# EAGLE design board (EAGLE 9.6.2)
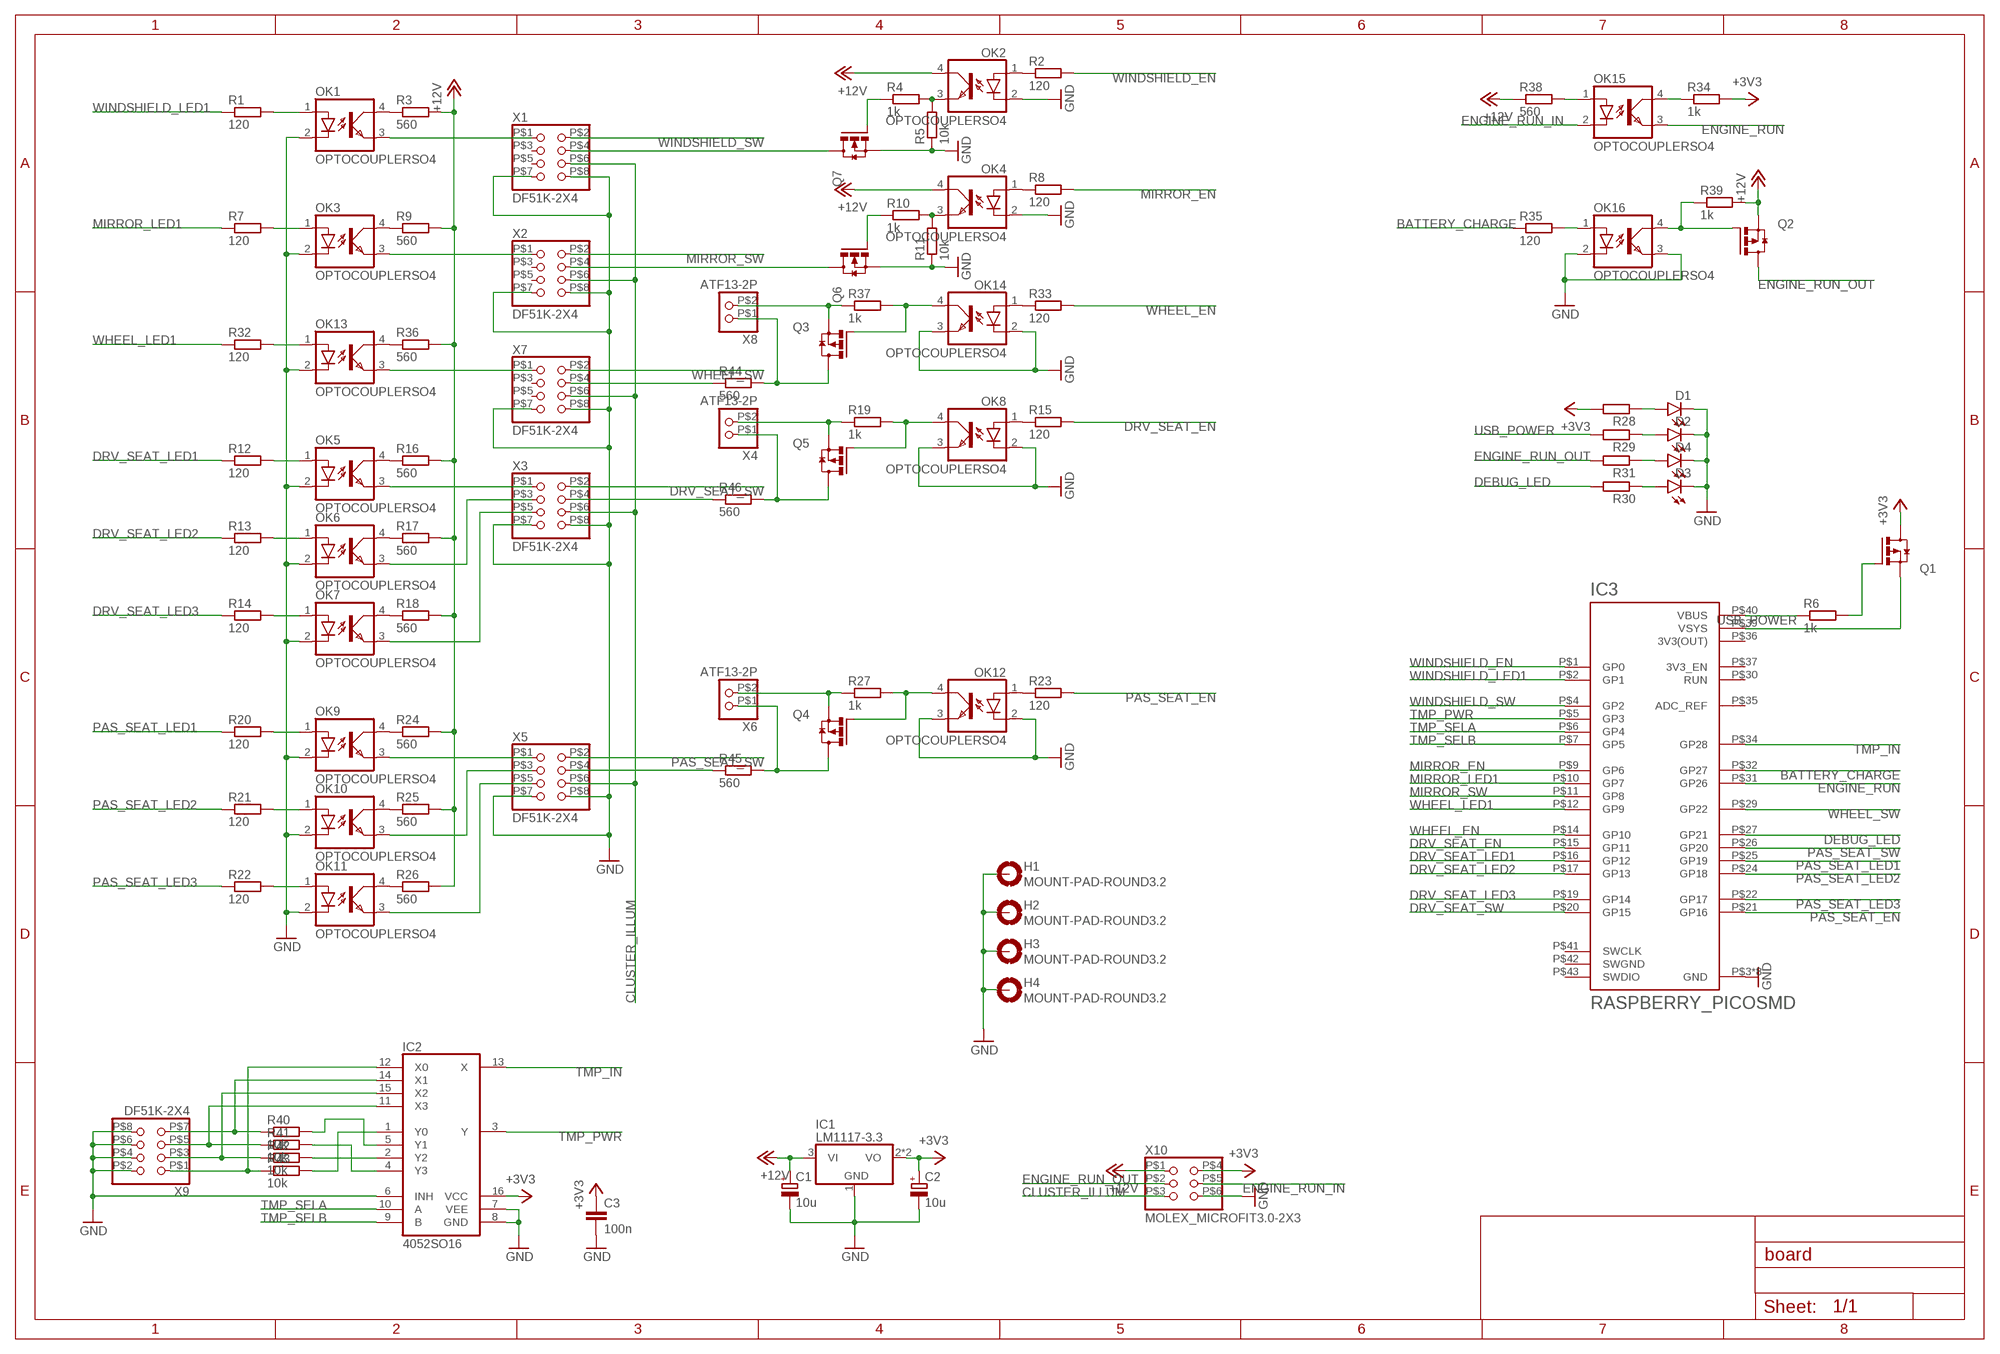
[diagram p0: schematic, sheet 1]

## Parts
C1  10u  CAPACITOR_POL4MM^2  [C_4MM]
C2  10u  CAPACITOR_POL4MM^2  [C_4MM]
C3  100n  CAPACITOR0805  [C0805]
D1  LED1206  [CHIPLED_1206]
D2  LED1206  [CHIPLED_1206]
D3  LED1206  [CHIPLED_1206]
D4  LED1206  [CHIPLED_1206]
H1  MOUNT-PAD-ROUND3.2  [3,2-PAD]
H2  MOUNT-PAD-ROUND3.2  [3,2-PAD]
H3  MOUNT-PAD-ROUND3.2  [3,2-PAD]
H4  MOUNT-PAD-ROUND3.2  [3,2-PAD]
IC1  LM1117-3.3  [SOT223]
IC2  4052SO16  [SO16]
IC3  RASPBERRY_PICOSMD  [PICO-PKG-SMD]
OK1  OPTOCOUPLERSO4  [SO04]
OK2  OPTOCOUPLERSO4  [SO04]
OK3  OPTOCOUPLERSO4  [SO04]
OK4  OPTOCOUPLERSO4  [SO04]
OK5  OPTOCOUPLERSO4  [SO04]
OK6  OPTOCOUPLERSO4  [SO04]
OK7  OPTOCOUPLERSO4  [SO04]
OK8  OPTOCOUPLERSO4  [SO04]
OK9  OPTOCOUPLERSO4  [SO04]
OK10  OPTOCOUPLERSO4  [SO04]
OK11  OPTOCOUPLERSO4  [SO04]
OK12  OPTOCOUPLERSO4  [SO04]
OK13  OPTOCOUPLERSO4  [SO04]
OK14  OPTOCOUPLERSO4  [SO04]
OK15  OPTOCOUPLERSO4  [SO04]
OK16  OPTOCOUPLERSO4  [SO04]
Q1  MOSFET_P_CHANNELSOT23  [SOT23]
Q2  MOSFET_P_CHANNELSOT23  [SOT23]
Q3  MOSFET_P_CHANNELTO252  [TO252]
Q4  MOSFET_P_CHANNELTO252  [TO252]
Q5  MOSFET_P_CHANNELTO252  [TO252]
Q6  MOSFET_N_CHANNELSOT23  [SOT23]
Q7  MOSFET_N_CHANNELSOT23  [SOT23]
R1  120  RESISTOR0805  [R0805]
R2  120  RESISTOR0805  [R0805]
R3  560  RESISTOR0805  [R0805]
R4  1k  RESISTOR0805  [R0805]
R5  10k  RESISTOR0805  [R0805]
R6  1k  RESISTOR0805  [R0805]
R7  120  RESISTOR0805  [R0805]
R8  120  RESISTOR0805  [R0805]
R9  560  RESISTOR0805  [R0805]
R10  1k  RESISTOR0805  [R0805]
R11  10k  RESISTOR0805  [R0805]
R12  120  RESISTOR0805  [R0805]
R13  120  RESISTOR0805  [R0805]
R14  120  RESISTOR0805  [R0805]
R15  120  RESISTOR0805  [R0805]
R16  560  RESISTOR0805  [R0805]
R17  560  RESISTOR0805  [R0805]
R18  560  RESISTOR0805  [R0805]
R19  1k  RESISTOR0805  [R0805]
R20  120  RESISTOR0805  [R0805]
R21  120  RESISTOR0805  [R0805]
R22  120  RESISTOR0805  [R0805]
R23  120  RESISTOR0805  [R0805]
R24  560  RESISTOR0805  [R0805]
R25  560  RESISTOR0805  [R0805]
R26  560  RESISTOR0805  [R0805]
R27  1k  RESISTOR0805  [R0805]
R28  RESISTOR0805  [R0805]
R29  RESISTOR0805  [R0805]
R30  RESISTOR0805  [R0805]
R31  RESISTOR0805  [R0805]
R32  120  RESISTOR0805  [R0805]
R33  120  RESISTOR0805  [R0805]
R34  1k  RESISTOR0805  [R0805]
R35  120  RESISTOR0805  [R0805]
R36  560  RESISTOR0805  [R0805]
R37  1k  RESISTOR0805  [R0805]
R38  560  RESISTOR0805  [R0805]
R39  1k  RESISTOR0805  [R0805]
R40  10k  RESISTOR0805  [R0805]
R41  10k  RESISTOR0805  [R0805]
R42  10k  RESISTOR0805  [R0805]
R43  10k  RESISTOR0805  [R0805]
R44  560  RESISTOR0805  [R0805]
R45  560  RESISTOR0805  [R0805]
R46  560  RESISTOR0805  [R0805]
X1  DF51K-2X4  [DF51K-2X4]
X2  DF51K-2X4  [DF51K-2X4]
X3  DF51K-2X4  [DF51K-2X4]
X4  ATF13-2P  [ATF13-2P]
X5  DF51K-2X4  [DF51K-2X4]
X6  ATF13-2P  [ATF13-2P]
X7  DF51K-2X4  [DF51K-2X4]
X8  ATF13-2P  [ATF13-2P]
X9  DF51K-2X4  [DF51K-2X4]
X10  MOLEX_MICROFIT3.0-2X3  [MOLEX_MICROFIT3.0-2X3]

## Nets
+3V3: C2.+ C3.1 IC1.2(VO) IC1.4(VO) IC2.16(VCC) Q1.3(D) R28.2 R34.2 X10.P$4
+12V: C1.+ IC1.3(VI) OK2.4(COL) OK4.4(COL) Q2.2(S) R3.2 R9.2 R16.2 R17.2 R18.2 R24.2 R25.2 R26.2 R36.2 R38.1 R39.2 X10.P$1
BATTERY_CHARGE: IC3.P$32(GP27) R35.1
CLUSTER_ILLUM: X1.P$6 X2.P$6 X3.P$6 X5.P$6 X7.P$6 X10.P$3
DEBUG_LED: IC3.P$27(GP21) R30.2
DRV_SEAT_EN: IC3.P$15(GP11) R15.2
DRV_SEAT_LED1: IC3.P$16(GP12) R12.1
DRV_SEAT_LED2: IC3.P$17(GP13) R13.1
DRV_SEAT_LED3: IC3.P$19(GP14) R14.1
DRV_SEAT_SW: IC3.P$20(GP15) X3.P$2
ENGINE_RUN: IC3.P$31(GP26) OK15.3(EMIT)
ENGINE_RUN_IN: OK15.2(C) X10.P$5
ENGINE_RUN_OUT: Q2.3(D) R31.2 X10.P$2
GND: C1.- C2.- C3.2 D1.C D2.C D3.C D4.C H1.B3,2(MOUNT) H1.P$1(MOUNT) H1.P$2(MOUNT) H1.P$3(MOUNT) H1.P$4(MOUNT) H1.P$5(MOUNT) H1.P$6(MOUNT) H1.P$7(MOUNT) H1.P$8(MOUNT) H2.B3,2(MOUNT) H2.P$1(MOUNT) H2.P$2(MOUNT) H2.P$3(MOUNT) H2.P$4(MOUNT) H2.P$5(MOUNT) H2.P$6(MOUNT) H2.P$7(MOUNT) H2.P$8(MOUNT) H3.B3,2(MOUNT) H3.P$1(MOUNT) H3.P$2(MOUNT) H3.P$3(MOUNT) H3.P$4(MOUNT) H3.P$5(MOUNT) H3.P$6(MOUNT) H3.P$7(MOUNT) H3.P$8(MOUNT) H4.B3,2(MOUNT) H4.P$1(MOUNT) H4.P$2(MOUNT) H4.P$3(MOUNT) H4.P$4(MOUNT) H4.P$5(MOUNT) H4.P$6(MOUNT) H4.P$7(MOUNT) H4.P$8(MOUNT) IC1.1(GND) IC2.6(INH) IC2.7(VEE) IC2.8(GND) IC3.P$3(GND) IC3.P$8(GND) IC3.P$13(GND) IC3.P$18(GND) IC3.P$23(GND) IC3.P$28(GND) IC3.P$33(GND) IC3.P$38(GND) OK1.2(C) OK2.2(C) OK3.2(C) OK4.2(C) OK5.2(C) OK6.2(C) OK7.2(C) OK8.2(C) OK8.3(EMIT) OK9.2(C) OK10.2(C) OK11.2(C) OK12.2(C) OK12.3(EMIT) OK13.2(C) OK14.2(C) OK14.3(EMIT) OK16.2(C) OK16.3(EMIT) Q6.2(S) Q7.2(S) R5.1 R11.1 X1.P$7 X1.P$8 X2.P$7 X2.P$8 X3.P$7 X3.P$8 X5.P$7 X5.P$8 X7.P$7 X7.P$8 X9.P$2 X9.P$4 X9.P$6 X9.P$8 X10.P$6
MIRROR_EN: IC3.P$9(GP6) R8.2
MIRROR_LED1: IC3.P$10(GP7) R7.1
MIRROR_SW: IC3.P$11(GP8) X2.P$2
N$1: OK1.3(EMIT) X1.P$1
N$2: OK1.4(COL) R3.1
N$3: OK3.4(COL) R9.1
N$4: OK13.4(COL) R36.1
N$5: IC2.1(Y0) R43.2
N$6: IC2.2(Y2) R42.2
N$7: OK5.4(COL) R16.1
N$8: OK6.4(COL) R17.1
N$9: OK7.4(COL) R18.1
N$10: OK9.4(COL) R24.1
N$11: OK10.4(COL) R25.1
N$12: OK11.4(COL) R26.1
N$13: OK3.3(EMIT) X2.P$1
N$14: OK13.3(EMIT) X7.P$1
N$15: IC2.4(Y3) R41.2
N$16: IC2.5(Y1) R40.2
N$17: OK9.3(EMIT) X5.P$1
N$18: OK5.3(EMIT) X3.P$1
N$19: OK6.3(EMIT) X3.P$3
N$20: OK7.3(EMIT) X3.P$5
N$21: OK10.3(EMIT) X5.P$3
N$22: OK11.3(EMIT) X5.P$5
N$23: OK1.1(A) R1.2
N$24: OK3.1(A) R7.2
N$25: OK13.1(A) R32.2
N$27: D1.A R28.1
N$28: OK5.1(A) R12.2
N$29: OK6.1(A) R13.2
N$30: OK7.1(A) R14.2
N$31: OK9.1(A) R20.2
N$32: OK10.1(A) R21.2
N$33: OK11.1(A) R22.2
N$35: IC2.14(X1) R40.1 X9.P$7
N$36: OK2.1(A) R2.1
N$37: OK2.3(EMIT) R4.2 R5.2
N$38: Q7.3(D) X1.P$4
N$39: Q7.1(G) R4.1
N$40: Q6.3(D) X2.P$4
N$41: OK4.3(EMIT) R10.2 R11.2
N$42: OK4.1(A) R8.1
N$43: Q6.1(G) R10.1
N$44: OK14.1(A) R33.1
N$45: Q3.2(S) R37.1 X8.P$2
N$46: OK14.4(COL) Q3.1(G) R37.2
N$47: Q3.3(D) R44.2 X8.P$1
N$48: R44.1 X7.P$4
N$49: R46.1 X3.P$4
N$50: Q5.3(D) R46.2 X4.P$1
N$51: OK8.1(A) R15.1
N$52: Q5.2(S) R19.1 X4.P$2
N$53: OK8.4(COL) Q5.1(G) R19.2
N$54: R45.1 X5.P$4
N$55: Q4.3(D) R45.2 X6.P$1
N$56: OK15.1(A) R38.2
N$57: Q4.2(S) R27.1 X6.P$2
N$58: OK12.1(A) R23.1
N$59: OK12.4(COL) Q4.1(G) R27.2
N$60: OK15.4(COL) R34.1
N$61: OK16.1(A) R35.2
N$62: OK16.4(COL) Q2.1(G) R39.1
N$63: IC2.11(X3) R41.1 X9.P$5
N$64: Q1.1(G) R6.2
N$65: IC3.P$39(VSYS) Q1.2(S)
N$66: D2.A R29.1
N$67: D4.A R31.1
N$69: D3.A R30.1
N$70: IC2.15(X2) R42.1 X9.P$3
N$71: IC2.12(X0) R43.1 X9.P$1
PAS_SEAT_EN: IC3.P$21(GP16) R23.2
PAS_SEAT_LED1: IC3.P$25(GP19) R20.1
PAS_SEAT_LED2: IC3.P$24(GP18) R21.1
PAS_SEAT_LED3: IC3.P$22(GP17) R22.1
PAS_SEAT_SW: IC3.P$26(GP20) X5.P$2
TMP_IN: IC2.13(X) IC3.P$34(GP28)
TMP_PWR: IC2.3(Y) IC3.P$5(GP3)
TMP_SELA: IC2.10(A) IC3.P$6(GP4)
TMP_SELB: IC2.9(B) IC3.P$7(GP5)
USB_POWER: IC3.P$40(VBUS) R6.1 R29.2
WHEEL_EN: IC3.P$14(GP10) R33.2
WHEEL_LED1: IC3.P$12(GP9) R32.1
WHEEL_SW: IC3.P$29(GP22) X7.P$2
WINDSHIELD_EN: IC3.P$1(GP0) R2.2
WINDSHIELD_LED1: IC3.P$2(GP1) R1.1
WINDSHIELD_SW: IC3.P$4(GP2) X1.P$2
Unconnected: IC3.P$30(RUN) IC3.P$35(ADC_REF) IC3.P$37(3V3_EN) IC3.P$41(SWCLK) IC3.P$43(SWDIO) X1.P$3 X1.P$5 X2.P$3 X2.P$5 X7.P$3 X7.P$5

## Power pins joined to a net without a drawn wire
3V3(OUT): IC3.P$36(3V3(OUT))
SWGND: IC3.P$42(SWGND)

## Library data of the parts
C1 C2 = SMD:CAPACITOR_POL
C3 = SMD:CAPACITOR
D1-D4 = SMD:LED
H1-H4 = THT:MOUNT-PAD-ROUND: MOUNTING PAD, round
IC1 = SMD:LM1117-3.3
IC2 = SMD:4052
IC3 = SMD:RASPBERRY_PICO: Raspberry Pi Pico
OK1-OK16 = SMD:OPTOCOUPLER
Q1-Q5 = SMD:MOSFET_P_CHANNEL
Q6 Q7 = SMD:MOSFET_N_CHANNEL
R1-R46 = SMD:RESISTOR
X1-X3 X5 X7 X9 = THT:DF51K-2X4
X4 X6 X8 = THT:ATF13-2P
X10 = THT:MOLEX_MICROFIT3.0-2X3

## Board
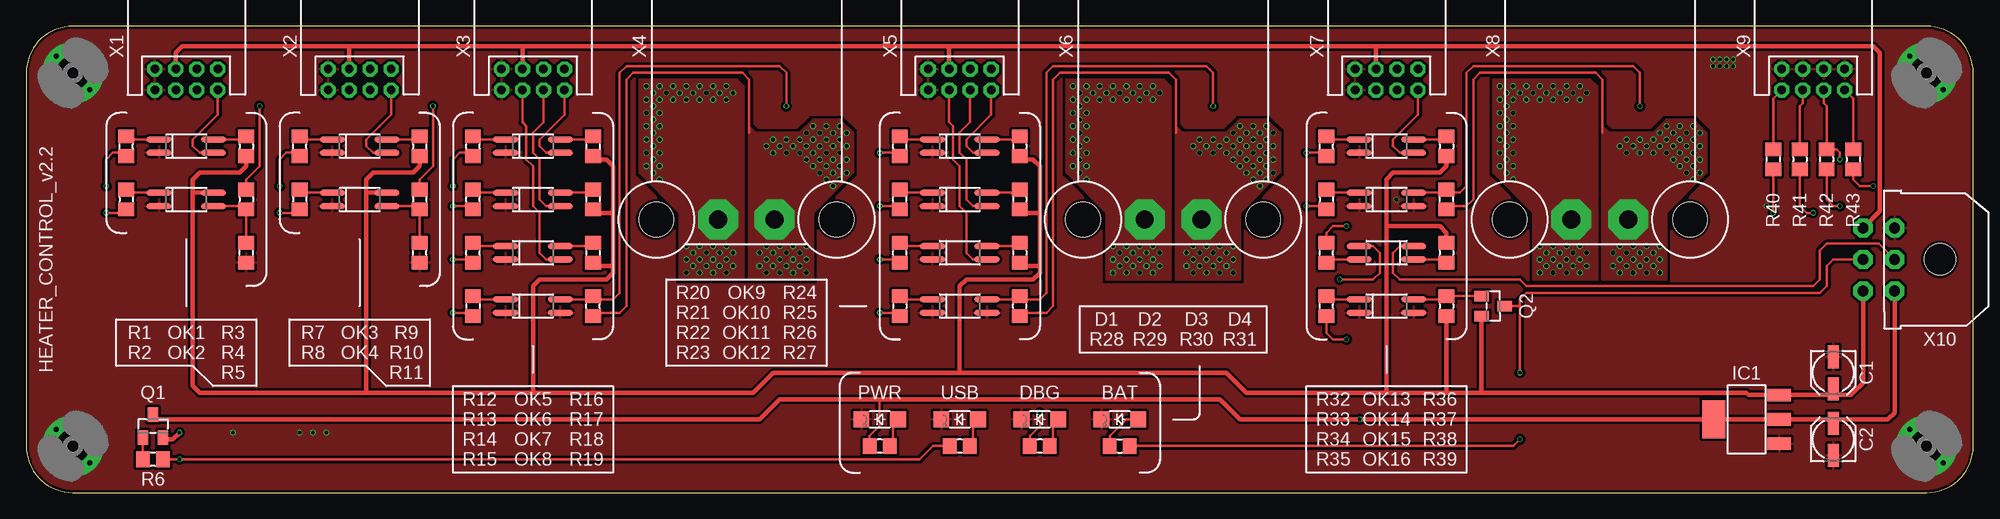
[diagram p1: board, top side]
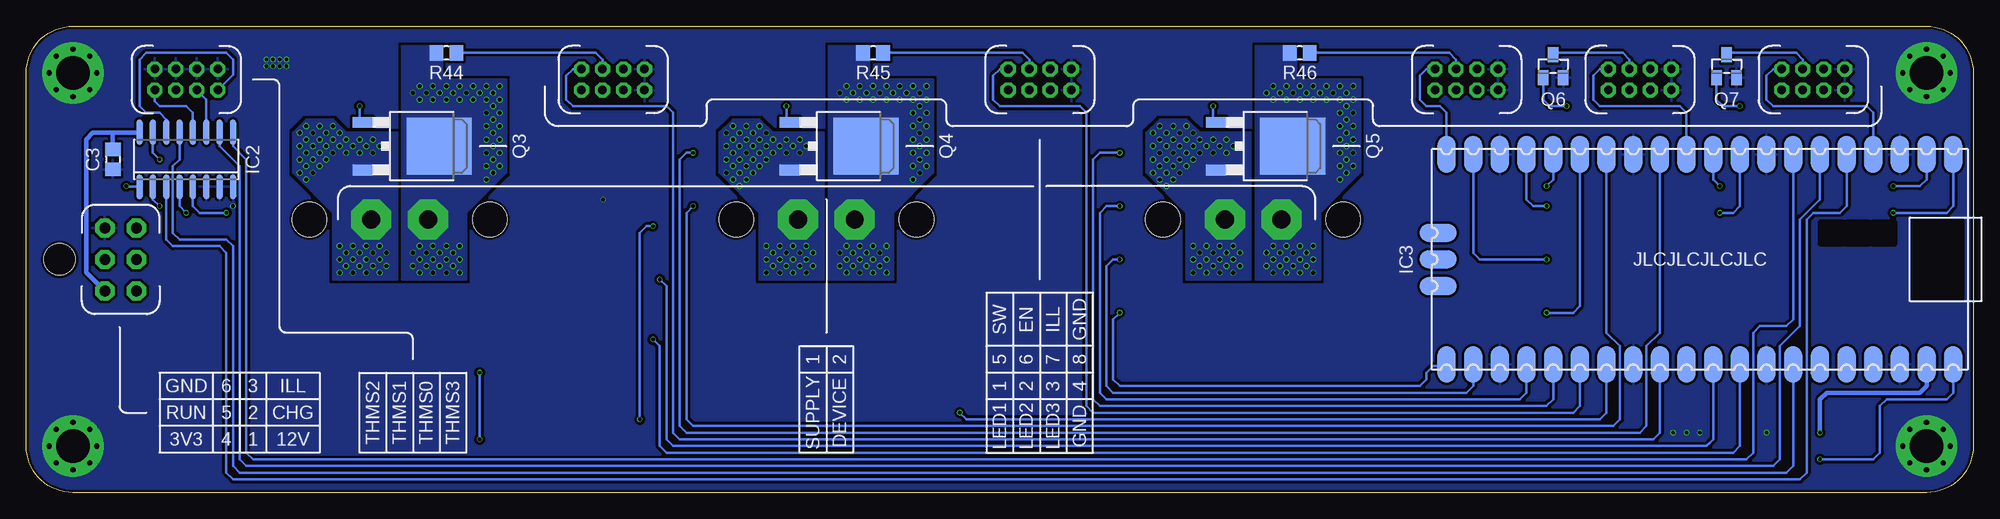
[diagram p2: board, bottom side, seen from below]

Size 185.42 x 44.45 mm. Coordinates in mm from the lower left corner, seen from the top.
Outline: 0,40.01 0,4.45 arc90 4.45,0 180.97,0 arc90 185.42,4.45 185.42,40.01 arc90 180.97,44.45 4.45,44.45 arc90 0,40.01
Copper layers (1*16): Top 0.035mm / dielectric 1.6mm / Bottom 0.035mm
Design rules "jlc-pcb *": minimum track width 5mil, minimum drill 0.3mm, track to track 5mil, track to pad 5mil, pad to pad 5mil, via to via 5mil, smd to smd 5mil, copper to edge 0.2mm, drill to drill 6mil, minimum pad ring 10mil, minimum via ring 3mil, stop-mask expansion 4mil, vias tented up to drill 16mil, thermal gap 10mil

### Footprints (pad centres in the part's own frame; a part is rotated, then mirrored left to right if it is on the bottom)
C_4MM = smd 2.184 x 1.067: + 1.524,0; - -1.524,0
C0805 = smd 1.3 x 1.5: 1 -0.95,0; 2 0.95,0
CHIPLED_1206 = smd 1.5 x 1.5: A 0,-1.75; C 0,1.75
3,2-PAD = drill 3.2 pad 5.842: B3,2 0,0 | drill 0.5: P$1 0,2.261; P$2 0,-2.261; P$3 2.261,0; P$4 -2.261,0; P$5 -1.598,1.598; P$6 1.598,1.598; P$7 -1.598,-1.598; P$8 1.598,-1.598
SOT223 = smd 1.219 x 2.235: 1 -2.311,-3.099; 2 0,-3.099; 3 2.311,-3.099 | smd 3.6 x 2.2: 4 0,3.099
SO16 = smd 0.559 x 2.388: 1 -4.445,-2.6; 2 -3.175,-2.6; 3 -1.905,-2.6; 4 -0.635,-2.6; 5 0.635,-2.6; 6 1.905,-2.6; 7 3.175,-2.6; 8 4.445,-2.6; 9 4.445,2.6; 10 3.175,2.6; 11 1.905,2.6; 12 0.635,2.6; 13 -0.635,2.6; 14 -1.905,2.6; 15 -3.175,2.6; 16 -4.445,2.6
PICO-PKG-SMD = smd 3.5 x 1.7: P$1 -10,24.13; P$2 -10,21.59; P$3 -10,19.05; P$4 -10,16.51; P$5 -10,13.97; P$6 -10,11.43; P$7 -10,8.89; P$8 -10,6.35; P$9 -10,3.81; P$10 -10,1.27; P$11 -10,-1.27; P$12 -10,-3.81; P$13 -10,-6.35; P$14 -10,-8.89; P$15 -10,-11.43; P$16 -10,-13.97; P$17 -10,-16.51; P$18 -10,-19.05; P$19 -10,-21.59; P$20 -10,-24.13; P$21 10,-24.13; P$22 10,-21.59; P$23 10,-19.05; P$24 10,-16.51; P$25 10,-13.97; P$26 10,-11.43; P$27 10,-8.89; P$28 10,-6.35; P$29 10,-3.81; P$30 10,-1.27; P$31 10,1.27; P$32 10,3.81; P$33 10,6.35; P$34 10,8.89; P$35 10,11.43; P$36 10,13.97; P$37 10,16.51; P$38 10,19.05; P$39 10,21.59; P$40 10,24.13 | smd 1.7 x 3.5: P$41 -2.54,-24.925; P$42 0,-24.925; P$43 2.54,-24.925
SO04 = smd 0.559 x 2.388: 1 -0.635,-2.6; 2 0.635,-2.6; 3 0.635,2.6; 4 -0.635,2.6
SOT23 = smd 1 x 1.4: 1 -0.95,-1.1; 2 0.95,-1.1; 3 0,1.1
TO252 = smd 1.016 x 1.905: 1 -2.28,-4.8; 2 2.28,-4.8 | smd 5.4 x 6.2: 3 0,2.5
R0805 = smd 1.3 x 1.5: 1 -0.95,0; 2 0.95,0
DF51K-2X4 = drill 0.8 octagon: P$1 -3,1; P$2 -3,-1; P$3 -1,1; P$4 -1,-1; P$5 1,1; P$6 1,-1; P$7 3,1; P$8 3,-1
ATF13-2P = drill 1.7 pad 3.81 octagon: P$1 2.7,0; P$2 -2.7,0 | hole 3.3: -8.585,0; 8.585,0
MOLEX_MICROFIT3.0-2X3 = drill 1.02 pad 1.778 octagon: P$1 -3,7.32; P$2 0,7.32; P$3 3,7.32; P$4 -3,4.32; P$5 0,4.32; P$6 3,4.32 | hole 3: 0,0

### Placement (x,y rotation side)
C1  172.09,11.43 270 top
C2  172.09,5.08 90 top
C3  177.16,31.75 270 bottom
D1  81.28,6.99 90 top
D2  88.9,6.99 90 top
D3  96.52,6.99 90 top
D4  104.14,6.99 90 top
H1  4.45,40.01 0 top
H2  4.45,4.45 0 top
H3  180.97,4.45 0 top
H4  180.97,40.01 0 top
IC1  163.83,6.99 90 top
IC2  170.18,31.75 0 bottom
IC3  26.04,22.23 270 bottom
OK1  15.24,33.02 270 top
OK2  15.24,27.94 270 top
OK3  31.75,33.02 270 top
OK4  31.75,27.94 270 top
OK5  48.26,33.02 270 top
OK6  48.26,27.94 270 top
OK7  48.26,22.86 270 top
OK8  48.26,17.78 270 top
OK9  88.9,33.02 270 top
OK10  88.9,27.94 270 top
OK11  88.9,22.86 270 top
OK12  88.9,17.78 270 top
OK13  129.54,33.02 270 top
OK14  129.54,27.94 270 top
OK15  129.54,22.86 90 top
OK16  129.54,17.78 270 top
Q1  12.06,6.35 0 top
Q2  139.7,17.78 270 top
Q3  148.59,33.02 270 bottom
Q4  107.95,33.02 270 bottom
Q5  67.31,33.02 270 bottom
Q6  40.01,40.64 0 bottom
Q7  23.5,40.64 0 bottom
R1  9.53,33.02 90 top
R2  9.53,27.94 270 top
R3  20.95,33.02 270 top
R4  20.95,27.94 270 top
R5  20.95,22.86 90 top
R6  12.06,3.17 180 top
R7  26.04,33.02 90 top
R8  26.04,27.94 270 top
R9  37.47,33.02 270 top
R10  37.47,27.94 270 top
R11  37.47,22.86 90 top
R12  42.55,33.02 90 top
R13  42.55,27.94 90 top
R14  42.55,22.86 90 top
R15  42.55,17.78 270 top
R16  53.98,33.02 270 top
R17  53.98,27.94 270 top
R18  53.98,22.86 270 top
R19  53.98,17.78 90 top
R20  83.19,33.02 90 top
R21  83.19,27.94 90 top
R22  83.19,22.86 90 top
R23  83.19,17.78 270 top
R24  94.61,33.02 270 top
R25  94.61,27.94 270 top
R26  94.61,22.86 270 top
R27  94.61,17.78 90 top
R28  81.28,4.45 180 top
R29  88.9,4.45 180 top
R30  96.52,4.45 180 top
R31  104.14,4.45 0 top
R32  123.83,33.02 90 top
R33  123.83,27.94 270 top
R34  123.83,22.86 90 top
R35  123.83,17.78 90 top
R36  135.25,33.02 270 top
R37  135.25,27.94 90 top
R38  135.25,22.86 270 top
R39  135.25,17.78 270 top
R40  166.37,31.75 270 top
R41  168.91,31.75 270 top
R42  171.45,31.75 270 top
R43  173.99,31.75 270 top
R44  145.41,41.91 180 bottom
R45  104.78,41.91 180 bottom
R46  64.14,41.91 180 bottom
X1  15.24,39.37 180 top
X2  31.75,39.37 180 top
X3  48.26,39.37 180 top
X4  68.58,26.04 180 top
X5  88.9,39.37 180 top
X6  109.22,26.04 180 top
X7  129.54,39.37 180 top
X8  149.86,26.04 180 top
X9  170.18,39.37 180 top
X10  182.25,22.23 90 top

### Tracks (layer width: path | path; a pad name or v marks a point on that pad's centre or on a via)
+3V3  (via drill 0.35)
  Top 0.254: R34.2 123.83,24.77 124.46,25.4 v125.73,25.4 | R28.2 80.33,5.4 81.28,6.35 81.28,8.89
  Top 0.406: 172.09,6.99 IC1.2 IC1.4 v127,6.99 115.57,6.99 113.67,8.89 81.28,8.89 71.75,8.89 69.85,6.99 12.38,6.99 12.06,7.3 Q1.3 | 172.09,6.99 177.29,6.99 177.93,7.62 X10.P$4 | C2.+ 172.09,6.99
  Bottom 0.254: v125.73,25.4 126.36,25.4 127,24.77 v127,6.99
  Bottom 0.406: C3.1 177.16,34.29 | IC2.16 174.69,34.29 177.16,34.29 | 177.16,34.29 179.07,34.29 179.71,33.66 179.71,21 X10.P$4
+12V
  Top 0.406: R3.2 20.95,31.11 20.32,30.48 16.51,30.48 15.88,29.84 15.88,28.57 | R9.2 37.47,31.11 36.83,30.48 33.02,30.48 32.38,29.84 32.38,28.57 | OK2.4 15.88,28.57 | OK4.4 32.38,28.57 | 55.88,21.59 55.88,20.95 55.24,20.32 48.9,20.32 48.26,19.68 48.26,9.53 | 55.88,21.59 55.88,26.67 | 55.88,26.67 55.88,31.11 55.24,31.75 54.3,31.75 R16.2 | R17.2 54.3,26.67 55.88,26.67 | R18.2 54.3,21.59 55.88,21.59 | R36.2 135.25,31.11 134.62,30.48 130.18,30.48 129.54,29.84 129.54,25.4 | R38.1 135.25,24.77 134.62,25.4 129.54,25.4 | 96.52,26.67 96.52,21.59 | 96.52,21.59 96.52,20.95 95.89,20.32 89.53,20.32 88.9,19.68 88.9,11.43 | R26.2 94.94,21.59 96.52,21.59 | R25.2 94.93,26.99 95.25,26.67 96.52,26.67 | R24.2 94.94,31.75 95.89,31.75 96.52,31.11 96.52,26.67 | 172.09,9.3 173.76,9.3 174.93,10.46 X10.P$1 | 172.09,9.3 IC1.3 164.06,9.3 163.83,9.53 138.6,9.53 | C1.+ 172.09,9.3 | 15.88,28.57 15.88,10.16 16.51,9.53 32.38,9.53 | 138.6,9.53 135.25,9.53 | 135.25,9.53 129.54,9.53 | 129.54,9.53 116.2,9.53 114.3,11.43 88.9,11.43 | 88.9,11.43 71.12,11.43 69.22,9.53 48.26,9.53 | 48.26,9.53 32.38,9.53 | 32.38,28.57 32.38,9.53 | 129.54,25.4 129.54,9.53 | R39.2 135.25,9.53 | Q2.2 138.6,9.53
BATTERY_CHARGE  (via drill 0.35)
  Top 0.254: v125.73,14.61 124.46,14.61 123.83,15.24 R35.1
  Bottom 0.254: IC3.P$32 22.23,4.45 22.86,3.81 124.46,3.81 125.09,4.45 125.09,13.97 v125.73,14.61
CLUSTER_ILLUM
  Top 0.406: X1.P$6 14.24,41.91 14.88,42.55 30.75,42.55 | 30.75,42.55 47.26,42.55 | 47.26,42.55 87.9,42.55 | 87.9,42.55 128.54,42.55 | X2.P$6 30.75,42.55 | X3.P$6 47.26,42.55 | X5.P$6 87.9,42.55 | X7.P$6 128.54,42.55 | 128.54,42.55 175.9,42.55 176.53,41.91 176.53,26.83 X10.P$3
DEBUG_LED  (via drill 0.35)
  Top 0.254: R30.2 95.57,5.4 96.52,6.35 v96.52,7.62
  Bottom 0.254: v96.52,7.62 95.89,6.99 35.56,6.99 34.92,7.62 IC3.P$27
DRV_SEAT_EN  (via drill 0.35)
  Top 0.254: R15.2 42.23,17.14 v40.64,17.14
  Bottom 0.254: IC3.P$15 37.47,17.78 38.1,17.14 v40.64,17.14
DRV_SEAT_LED1  (via drill 0.35)
  Top 0.254: v40.64,29.21 40.64,31.75 41.27,32.38 42.23,32.38 R12.1
  Bottom 0.254: IC3.P$16 40.01,29.84 v40.64,29.21
DRV_SEAT_LED2  (via drill 0.35)
  Top 0.254: v40.64,27.3 42.23,27.3 R13.1
  Bottom 0.254: IC3.P$17 42.55,27.94 41.91,27.3 v40.64,27.3
DRV_SEAT_LED3  (via drill 0.35)
  Top 0.254: v40.64,22.23 42.23,22.23 R14.1
  Bottom 0.254: IC3.P$19 47.62,22.86 46.99,22.23 v40.64,22.23
DRV_SEAT_SW
  Bottom 0.254: X3.P$2 52.07,40.37 52.7,39.73 52.7,37.47 52.07,36.83 50.8,36.83 50.16,36.2 IC3.P$20
ENGINE_RUN  (via drill 0.35)
  Top 0.254: OK15.3 128.27,23.5 128.91,22.86 128.91,20.95 128.27,20.32 v125.09,20.32
  Bottom 0.254: IC3.P$31 24.77,5.08 25.08,4.76 25.4,4.45 123.83,4.45 124.46,5.08 124.46,19.68 v125.09,20.32
ENGINE_RUN_IN
  Top 0.254: OK15.2 130.81,23.5 130.18,22.86 130.18,20.95 130.81,20.32 142.24,20.32 142.88,19.68 170.18,19.68 170.81,20.32 170.81,23.09 171.45,23.72 176.43,23.72 X10.P$5
ENGINE_RUN_OUT  (via drill 0.35)
  Top 0.254: 142.24,17.78 142.24,18.41 142.88,19.05 170.81,19.05 171.45,19.68 171.45,21.59 172.09,22.23 X10.P$2 | Q2.3 142.24,17.78 | 142.24,17.78 v142.24,11.43 | R31.2 141.6,4.45 v142.24,5.08
  Bottom 0.254: v142.24,11.43 v142.24,5.08
GND  (via drill 0.35)
  other vias: 130.49,27.94 165.74,27.3 19.68,5.71 28.57,5.71 27.3,5.71 26.04,5.71 160.66,41.27 161.29,41.27 161.93,41.27 162.56,41.27 162.56,40.64 161.93,40.64 161.29,40.64 160.66,40.64
  pour Top (isolate 0.254, rank 2): 0,44.45 185.42,44.45 185.42,0 0,0
  pour Bottom (isolate 0.254, rank 2): 0,44.45 185.42,44.45 185.42,0 0,0
MIRROR_EN  (via drill 0.35)
  Top 0.254: R8.2 25.88,26.83 25.71,26.67 v24.13,26.67
  Bottom 0.254: IC3.P$9 22.23,27.3 22.86,26.67 v24.13,26.67
MIRROR_LED1  (via drill 0.35)
  Top 0.254: R7.1 25.72,32.38 24.77,32.38 24.13,31.75 v24.13,29.21
  Bottom 0.254: IC3.P$10 24.77,29.84 v24.13,29.21
MIRROR_SW
  Bottom 0.254: X2.P$2 35.56,40.37 36.2,39.73 36.2,37.47 35.56,36.83 27.94,36.83 27.3,36.2 IC3.P$11
N$1
  Top 0.254: OK1.3 16.51,32.38 15.88,33.02 15.88,33.66 18.24,36.02 X1.P$1
N$2
  Top 0.254: R3.1 20.64,33.66 OK1.4
N$3
  Top 0.254: OK3.4 37.15,33.66 R9.1
N$4
  Top 0.254: OK13.4 134.94,33.66 R36.1
N$5  (via drill 0.35)
  Top 0.254: R43.2 173.99,29.84 174.62,29.21 v175.9,29.21
  Bottom 0.254: v175.9,29.21 175.84,29.15 IC2.1
N$6  (via drill 0.35)
  Top 0.254: v172.72,27.3 172.09,27.3 171.45,27.94 R42.2
  Bottom 0.254: v172.72,27.3 173.35,27.94 IC2.2
N$7
  Top 0.254: OK5.4 53.66,33.66 R16.1
N$8
  Top 0.254: OK6.4 53.66,28.57 R17.1
N$9
  Top 0.254: OK7.4 53.66,23.5 R18.1
N$10
  Top 0.254: OK9.4 94.3,33.66 R24.1
N$11
  Top 0.254: OK10.4 94.3,28.57 R25.1
N$12
  Top 0.254: OK11.4 94.3,23.5 R26.1
N$13
  Top 0.254: OK3.3 33.02,32.38 32.38,33.02 32.38,33.66 33.66,34.92 34.75,36.02 X2.P$1
N$14
  Top 0.254: OK13.3 130.81,32.38 130.18,33.02 130.18,33.66 132.54,36.02 X7.P$1
N$15  (via drill 0.35)
  Top 0.254: R41.2 168.91,27.3 169.54,26.67 v170.18,26.67
  Bottom 0.254: v170.18,26.67 170.81,27.3 IC2.4
N$16  (via drill 0.35)
  Top 0.254: R40.2 v166.37,26.67
  Bottom 0.254: IC2.5 169.54,27.3 168.91,26.67 v166.37,26.67
N$17
  Top 0.254: OK9.3 90.17,32.38 89.53,33.02 89.53,33.66 91.9,36.02 X5.P$1
N$18
  Top 0.254: OK5.3 49.53,32.38 48.9,33.02 48.9,33.66 51.26,36.02 X3.P$1
N$19
  Top 0.254: OK6.3 49.53,27.3 48.9,27.94 48.9,31.75 48.26,32.38 48.26,34.29 49.26,35.29 X3.P$3
N$20
  Top 0.254: OK7.3 49.53,22.23 48.9,22.86 48.9,26.67 48.26,27.3 48.26,31.11 47.62,31.75 47.62,34.92 47.26,35.29 X3.P$5
N$21
  Top 0.254: OK10.3 90.17,27.3 89.53,27.94 89.53,31.75 88.9,32.38 88.9,34.29 89.9,35.29 X5.P$3
N$22
  Top 0.254: OK11.3 90.17,22.23 89.53,22.86 89.53,26.67 88.9,27.3 88.9,31.11 88.27,31.75 88.27,34.92 87.9,35.29 X5.P$5
N$23
  Top 0.254: OK1.1 9.84,33.66 R1.2
N$24
  Top 0.254: OK3.1 26.35,33.66 R7.2
N$25
  Top 0.254: OK13.1 124.14,33.66 R32.2
N$27
  Top 0.254: R28.1 82.55,4.76 82.55,6.5 D1.A
N$28
  Top 0.254: OK5.1 42.86,33.66 R12.2
N$29
  Top 0.254: OK6.1 42.86,28.57 R13.2
N$30
  Top 0.254: OK7.1 42.86,23.5 R14.2
N$31
  Top 0.254: OK9.1 83.5,33.66 R20.2
N$32
  Top 0.254: OK10.1 83.5,28.57 R21.2
N$33
  Top 0.254: R22.2 83.5,23.5 OK11.1
N$35
  Top 0.254: X9.P$7 166.37,37.56 R40.1
  Bottom 0.254: IC2.14 172.09,35.56 172.72,36.2 173.99,36.2 174.62,36.83 174.62,41.27 173.99,41.91 166.37,41.91 165.74,41.27 165.74,39.81 X9.P$7
N$36
  Top 0.254: OK2.1 9.84,28.57 R2.1
N$37
  Top 0.254: OK2.3 20.64,27.3 R4.2 R5.2
N$38
  Bottom 0.254: X1.P$4 16.24,41.27 16.88,41.91 23.5,41.91 23.32,41.27 Q7.3
N$39  (via drill 0.35)
  Top 0.254: R4.1 20.95,29.84 22.23,31.11 v22.23,36.83
  Bottom 0.254: Q7.1 24.45,37.47 23.81,36.83 v22.23,36.83
N$40
  Bottom 0.254: X2.P$4 32.75,41.27 33.38,41.91 39.84,41.91 Q6.3
N$41
  Top 0.254: OK4.3 37.15,27.3 R10.2 R11.2
N$42
  Top 0.254: OK4.1 26.35,28.57 R8.1
N$43  (via drill 0.35)
  Top 0.254: R10.1 37.47,29.84 38.73,31.11 v38.73,36.83
  Bottom 0.254: Q6.1 40.95,37.47 40.32,36.83 v38.73,36.83
N$44
  Top 0.254: OK14.1 124.14,28.57 R33.1
N$45  (via drill 0.4)
  Top 0.254: R37.1 135.57,27.3 137.16,27.3 137.79,27.94 137.79,39.37 138.43,40.01 149.48,40.01 150.11,39.37 150.11,34.29
  other vias: 155.57,20.95 154.31,20.95 153.03,20.95 151.76,20.95 151.76,22.23 153.03,22.23 154.31,22.23 155.57,22.23 155.57,23.5 154.31,23.5 153.03,23.5 151.76,23.5 151.13,22.86 151.13,21.59 152.4,21.59 152.4,22.86 153.67,22.86 153.67,21.59 154.94,21.59 154.94,22.86 152.4,33.66 151.76,33.02 152.4,32.38 153.03,33.02 153.67,33.66 153.67,32.38 154.31,33.02 154.94,33.66 154.94,32.38 155.57,33.02 156.21,32.38 156.84,31.75 157.48,31.11 158.12,30.48 158.75,29.84 155.57,34.29 156.21,33.66 156.84,33.02 157.48,32.38 158.12,31.75 158.75,31.11 159.38,30.48 159.38,31.75 159.38,33.02 159.38,34.29 158.75,34.92 158.75,33.66 158.75,32.38 158.12,33.02 157.48,33.66 156.84,34.29 156.21,34.92 157.48,34.92 158.12,34.29
  pour Bottom (isolate 0.254, no thermals): 150.11,20.32 150.11,34.29 154.94,34.29 156.21,35.56 158.75,35.56 160.02,34.29 160.02,30.48 156.21,26.67 156.21,20.32
  pour Top (isolate 0.254, no thermals): 150.11,20.32 150.11,34.92 150.75,34.29 154.94,34.29 156.21,35.56 158.75,35.56 160.02,34.29 160.02,30.48 156.21,26.67 156.21,20.32
N$46  (via drill 0.35)
  Top 0.254: OK14.4 135.25,28.57 R37.2 135.57,28.57 136.53,28.57 137.16,29.21 137.16,40.01 137.79,40.64 153.03,40.64 153.67,40.01 v153.67,36.83
  Bottom 0.254: v153.67,36.83 153.67,35.58 Q3.1
N$47  (via drill 0.4)
  other vias: 144.15,20.95 144.15,22.23 144.15,23.5 145.41,23.5 146.69,23.5 147.96,23.5 147.96,22.23 146.69,22.23 145.41,22.23 145.41,20.95 146.69,20.95 147.96,20.95 148.59,21.59 148.59,22.86 147.32,22.86 147.32,21.59 146.05,21.59 146.05,22.86 144.78,22.86 144.78,21.59 140.34,31.11 140.97,30.48 141.6,29.84 141.6,31.11 140.97,31.75 140.34,32.38 140.34,33.66 140.97,33.02 141.6,32.38 141.6,33.66 140.97,34.29 140.34,34.92 140.34,36.2 140.97,35.56 141.6,34.92 141.6,36.2 140.97,36.83 140.34,37.47 140.34,38.73 140.97,38.1 141.6,37.47 141.6,38.73 142.24,38.1 142.88,37.47 142.88,38.73 143.51,38.1 144.15,37.47 144.15,38.73 144.78,38.1 145.41,37.47 145.41,38.73 146.05,38.1 146.69,37.47 146.69,38.73 147.32,38.1 147.96,37.47 147.96,38.73 148.59,38.1
  pour Bottom (isolate 0.254, no thermals): 149.61,20.32 149.61,42.55 145.8,42.55 145.8,40.01 145.16,39.37 139.7,39.37 139.7,30.48 143.51,26.67 143.51,20.32
  pour Top (isolate 0.254, no thermals): 148.97,39.37 139.7,39.37 139.7,30.48 143.51,26.67 143.51,20.32 149.61,20.32 149.61,38.73
N$48
  Bottom 0.254: X7.P$4 130.54,41.27 131.18,41.91 R44.1
N$49
  Bottom 0.254: X3.P$4 49.26,41.27 49.9,41.91 R46.1
N$50  (via drill 0.4)
  other vias: 59.69,30.48 59.05,31.11 60.33,31.11 59.69,31.75 59.05,32.38 60.33,32.38 59.69,33.02 59.05,33.66 60.33,33.66 59.69,34.29 59.05,34.92 60.33,34.92 59.69,35.56 59.05,36.2 60.33,36.2 59.69,36.83 59.05,37.47 60.33,37.47 59.69,38.1 59.05,38.73 60.33,38.73 60.96,38.1 61.59,37.47 61.59,38.73 62.23,38.1 62.87,37.47 62.87,38.73 63.5,38.1 64.14,37.47 64.14,38.73 64.77,38.1 65.41,37.47 65.41,38.73 66.04,38.1 66.67,37.47 66.67,38.73 67.31,38.1 60.33,29.84 62.87,20.95 64.14,20.95 65.41,20.95 66.67,20.95 62.87,22.23 62.87,23.5 64.14,23.5 65.41,23.5 66.67,23.5 66.67,22.23 65.41,22.23 64.14,22.23 63.5,22.86 63.5,21.59 64.77,22.86 64.77,21.59 66.04,22.86 66.04,21.59 67.31,22.86 67.31,21.59
  pour Bottom (isolate 0.254, no thermals): 58.42,39.37 58.42,30.48 62.23,26.67 62.23,20.32 68.33,20.32 68.33,42.55 64.52,42.55 64.52,40.01 63.88,39.37
  pour Top (isolate 0.254, no thermals): 58.42,39.37 58.42,30.48 62.23,26.67 62.23,20.32 68.33,20.32 68.33,38.73 67.69,39.37
N$51
  Top 0.254: OK8.1 42.86,18.41 R15.1
N$52  (via drill 0.4)
  Top 0.254: R19.1 54.29,17.14 56.52,17.14 57.15,17.78 57.15,39.37 57.78,40.01 68.2,40.01 68.83,39.37 68.83,34.29
  other vias: 71.12,33.66 72.39,33.66 73.66,33.66 74.93,33.66 76.2,33.66 77.47,33.66 70.48,33.02 71.12,32.38 71.75,33.02 72.39,32.38 73.03,33.02 73.66,32.38 74.3,33.02 74.93,32.38 75.56,33.02 76.2,32.38 76.83,33.02 77.47,32.38 78.11,33.02 75.56,31.75 76.83,31.75 76.2,31.11 74.3,31.75 74.93,31.11 75.56,30.48 74.3,20.95 73.03,20.95 71.75,20.95 70.48,20.95 69.85,21.59 71.12,21.59 72.39,21.59 73.66,21.59 74.3,22.23 73.03,22.23 71.75,22.23 70.48,22.23 69.85,22.86 71.12,22.86 72.39,22.86 73.66,22.86 74.3,23.5 73.03,23.5 71.75,23.5 70.48,23.5 78.11,34.29 77.47,34.92 74.3,34.29 74.93,34.92 75.56,34.29 76.2,34.92 76.83,34.29 76.83,30.48 76.2,29.84 77.47,31.11 78.11,31.75 76.83,29.21 77.47,29.84 78.11,30.48
  pour Bottom (isolate 0.254, no thermals): 68.83,20.32 68.83,34.29 73.66,34.29 74.93,35.56 77.47,35.56 78.74,34.29 78.74,30.48 74.93,26.67 74.93,20.32
  pour Top (isolate 0.254, no thermals): 68.83,20.32 68.83,34.92 69.47,34.29 73.66,34.29 74.93,35.56 77.47,35.56 78.74,34.29 78.74,30.48 74.93,26.67 74.93,20.32
N$53  (via drill 0.35)
  Top 0.254: OK8.4 53.66,18.41 R19.2 54.29,18.41 55.88,18.41 56.52,19.05 56.52,40.01 57.15,40.64 71.75,40.64 72.39,40.01 v72.39,36.83
  Bottom 0.254: v72.39,36.83 72.39,35.58 Q5.1
N$54
  Bottom 0.254: X5.P$4 89.9,41.27 90.53,41.91 R45.1
N$55  (via drill 0.4)
  other vias: 103.5,20.95 104.78,20.95 106.05,20.95 107.31,20.95 103.5,22.23 103.5,23.5 104.78,23.5 106.05,23.5 107.31,23.5 107.31,22.23 106.05,22.23 104.78,22.23 104.14,21.59 104.14,22.86 105.41,22.86 105.41,21.59 106.68,21.59 106.68,22.86 107.95,22.86 107.95,21.59 99.69,31.11 100.33,30.48 100.97,29.84 99.69,32.38 100.33,31.75 100.97,31.11 100.97,32.38 100.33,33.02 99.69,33.66 99.69,34.92 100.33,34.29 100.97,33.66 100.97,34.92 100.33,35.56 99.69,36.2 99.69,37.47 99.69,38.73 100.33,36.83 100.33,38.1 100.97,36.2 100.97,37.47 100.97,38.73 102.23,38.73 103.5,38.73 104.78,38.73 106.05,38.73 107.31,38.73 101.6,38.1 102.87,38.1 104.14,38.1 105.41,38.1 106.68,38.1 107.95,38.1 102.23,37.47 103.5,37.47 104.78,37.47 106.05,37.47 107.31,37.47
  pour Top (isolate 0.254, no thermals): 99.06,39.37 108.33,39.37 108.97,38.73 108.97,20.32 102.87,20.32 102.87,26.67 99.06,30.48
  pour Bottom (isolate 0.254, no thermals): 99.06,39.37 104.52,39.37 105.16,40.01 105.16,42.55 108.97,42.55 108.97,20.32 102.87,20.32 102.87,26.67 99.06,30.48
N$56
  Top 0.254: OK15.1 134.94,22.23 R38.2
N$57  (via drill 0.4)
  Top 0.254: R27.1 94.93,17.14 97.16,17.14 97.79,17.78 97.79,39.37 98.42,40.01 108.84,40.01 109.47,39.37 109.47,34.29
  other vias: 114.94,20.95 113.67,20.95 112.39,20.95 111.12,20.95 114.94,22.23 113.67,22.23 112.39,22.23 111.12,22.23 112.39,23.5 111.12,23.5 113.67,23.5 114.94,23.5 114.3,21.59 113.03,21.59 111.76,21.59 110.49,21.59 110.49,22.86 111.76,22.86 113.03,22.86 114.3,22.86 115.57,34.92 114.94,34.29 114.3,33.66 113.67,33.02 113.03,32.38 111.76,32.38 111.12,33.02 111.76,33.66 112.39,33.02 113.03,33.66 114.3,32.38 114.94,33.02 115.57,32.38 116.2,31.75 116.84,31.11 117.47,30.48 118.11,31.11 118.75,31.75 118.75,33.02 118.75,34.29 118.11,34.92 116.84,34.92 115.57,33.66 116.2,34.29 116.84,33.66 117.47,34.29 118.11,33.66 117.47,33.02 116.2,33.02 116.84,32.38 118.11,32.38 117.47,31.75 114.94,31.75 115.57,31.11 116.2,30.48 116.84,29.84 117.47,29.21 118.11,29.84 118.75,30.48
  pour Top (isolate 0.254, no thermals): 109.47,20.32 115.57,20.32 115.57,26.67 119.38,30.48 119.38,34.29 118.11,35.56 115.57,35.56 114.3,34.29 110.11,34.29 109.47,34.92
  pour Bottom (isolate 0.254, no thermals): 109.47,20.32 115.57,20.32 115.57,26.67 119.38,30.48 119.38,34.29 118.11,35.56 115.57,35.56 114.3,34.29 109.47,34.29
N$58
  Top 0.254: OK12.1 83.5,18.41 R23.1
N$59  (via drill 0.35)
  Top 0.254: OK12.4 94.3,18.41 R27.2 94.93,18.41 96.52,18.41 97.16,19.05 97.16,40.01 97.79,40.64 112.39,40.64 112.71,40.32 113.03,40.01 v113.03,36.83
  Bottom 0.254: v113.03,36.83 113.03,35.58 Q4.1
N$60
  Top 0.254: R34.1 124.14,22.23 OK15.4
N$61
  Top 0.254: OK16.1 124.14,18.41 R35.2
N$62
  Top 0.254: OK16.4 134.94,18.41 R39.1 Q2.1
N$63
  Top 0.254: X9.P$5 169.18,37.1 168.91,36.83 R41.1
  Bottom 0.254: IC2.11 168.28,37.47 X9.P$5
N$64
  Top 0.254: R6.2 Q1.1
N$65  (via drill 0.35)
  Top 0.406: v14.61,5.71 13.97,5.08 13.19,5.08 Q1.2
  Bottom 0.406: v14.61,5.71 14.61,8.89 13.97,9.53 5.08,9.53 4.45,10.16 IC3.P$39
N$66
  Top 0.254: R29.1 90.17,4.76 90.17,6.5 D2.A
N$67
  Top 0.254: D4.A 105.65,6.75 105.41,6.99 104.78,6.99 103.19,5.4 R31.1
N$69
  Top 0.254: R30.1 97.79,4.76 97.79,6.99 D3.A
N$70  (via drill 0.35)
  Top 0.254: X9.P$3 171.18,37.1 171.45,36.83 R42.1 172.41,32.7 172.72,32.38 v172.72,31.75
  Bottom 0.254: v172.72,31.75 173.35,32.38 IC2.15
N$71
  Top 0.254: X9.P$1 173.99,37.56 R43.1
  Bottom 0.254: IC2.12 169.54,36.2 170.18,36.83 172.72,36.83 173.18,37.29 X9.P$1
PAS_SEAT_EN  (via drill 0.35)
  Top 0.254: v81.28,17.14 82.87,17.14 R23.2
  Bottom 0.254: v81.28,17.14 81.92,16.51 81.92,10.79 81.28,10.16 52.7,10.16 52.07,10.79 52.07,11.43 51.44,12.06 50.33,12.06 IC3.P$21
PAS_SEAT_LED1  (via drill 0.35)
  Top 0.254: v81.28,32.38 82.87,32.38 R20.1
  Bottom 0.254: v81.28,32.38 83.19,32.38 83.82,31.75 83.82,8.89 83.19,8.26 40.64,8.26 40.01,8.89 IC3.P$25
PAS_SEAT_LED2  (via drill 0.35)
  Top 0.254: v81.28,27.3 82.87,27.3 R21.1
  Bottom 0.254: v81.28,27.3 82.55,27.3 83.19,26.67 83.19,9.53 82.55,8.89 43.18,8.89 42.55,9.53 IC3.P$24
PAS_SEAT_LED3  (via drill 0.35)
  Top 0.254: v81.28,22.23 82.87,22.23 R22.1
  Bottom 0.254: v81.28,22.23 81.92,22.23 82.55,21.59 82.55,10.16 81.92,9.53 48.26,9.53 47.62,10.16 IC3.P$22
PAS_SEAT_SW
  Bottom 0.254: X5.P$2 92.71,40.37 93.34,39.73 93.34,37.47 92.71,36.83 85.09,36.83 84.45,36.2 84.45,8.26 83.82,7.62 38.1,7.62 37.47,8.26 IC3.P$26
TMP_IN
  Bottom 0.254: IC2.13 170.81,31.75 171.45,31.11 171.45,24.77 170.81,24.13 166.37,24.13 165.74,23.5 165.74,2.54 165.1,1.91 17.78,1.91 17.14,2.54 IC3.P$34
TMP_PWR
  Bottom 0.254: IC3.P$5 12.06,27.3 12.7,26.67 15.24,26.67 15.88,26.04 15.88,1.91 16.51,1.27 165.74,1.27 166.37,1.91 166.37,22.86 167,23.5 171.45,23.5 172.09,24.13 IC2.3
TMP_SELA
  Bottom 0.254: IC3.P$6 14.61,27.94 16.51,26.04 16.51,15.88 18.41,13.97 18.41,3.17 19.05,2.54 164.47,2.54 165.1,3.17 165.1,31.11 167,33.02 IC2.10
TMP_SELB
  Bottom 0.254: IC2.9 165.74,33.02 164.47,31.75 164.47,3.81 163.83,3.17 21.59,3.17 20.95,3.81 20.95,15.24 20.32,15.88 17.78,15.88 17.14,16.51 IC3.P$7
USB_POWER  (via drill 0.35)
  Top 0.254: R6.1 v14.61,3.17 85.09,3.17 86.36,4.45 R29.2
  Bottom 0.254: v14.61,3.17 9.53,3.17 8.89,3.81 8.89,8.26 8.26,8.89 2.54,8.89 1.91,9.53 IC3.P$40
WHEEL_EN  (via drill 0.35)
  Top 0.254: v121.92,27.3 123.51,27.3 R33.2
  Bottom 0.254: IC3.P$14 34.92,15.24 33.66,13.97 33.66,6.99 34.29,6.35 121.92,6.35 122.56,6.99 122.56,26.67 v121.92,27.3
WHEEL_LED1  (via drill 0.35)
  Top 0.254: v121.92,32.38 123.51,32.38 R32.1
  Bottom 0.254: IC3.P$12 29.84,15.24 31.11,13.97 31.11,6.35 31.75,5.71 122.56,5.71 123.19,6.35 123.19,31.75 122.56,32.38 v121.92,32.38
WHEEL_SW
  Bottom 0.254: IC3.P$29 29.84,5.71 30.48,5.08 123.19,5.08 123.83,5.71 123.83,36.2 124.46,36.83 133.35,36.83 133.99,37.47 133.99,39.73 133.35,40.37 X7.P$2
WINDSHIELD_EN  (via drill 0.35)
  Top 0.254: R2.2 9.21,26.67 v7.62,26.67
  Bottom 0.254: IC3.P$1 1.91,27.3 2.54,26.67 v7.62,26.67
WINDSHIELD_LED1  (via drill 0.35)
  Top 0.254: v7.62,29.21 7.62,31.75 8.26,32.38 9.21,32.38 R1.1
  Bottom 0.254: IC3.P$2 4.45,29.84 5.08,29.21 v7.62,29.21
WINDSHIELD_SW
  Bottom 0.254: IC3.P$4 9.53,36.2 10.16,36.83 19.05,36.83 19.68,37.47 19.68,39.73 19.05,40.37 X1.P$2

### Text on the board
tPlace: HEATER_CONTROL_v2.2 | PWR | USB | DBG | BAT
bPlace: JLCJLCJLCJLC | GND | ILL | EN | SW | 8 | 7 | 6 | 5 | 2 | 1 | 4 | 3 | 2 | 1 | ILL | 3 | 6 | GND | DEVICE | SUPPLY | THMS3 | THMS0 | THMS1 | THMS2 | CHG | 2 | 5 | RUN | GND | LED3 | LED2 | LED1 | 12V | 1 | 4 | 3V3